# EAGLE schematic MKR_IMU_GPS_C_loop_v1 (2) (EAGLE 9.6.2)

## Sheet 1 of 4: 4-20mA->5V
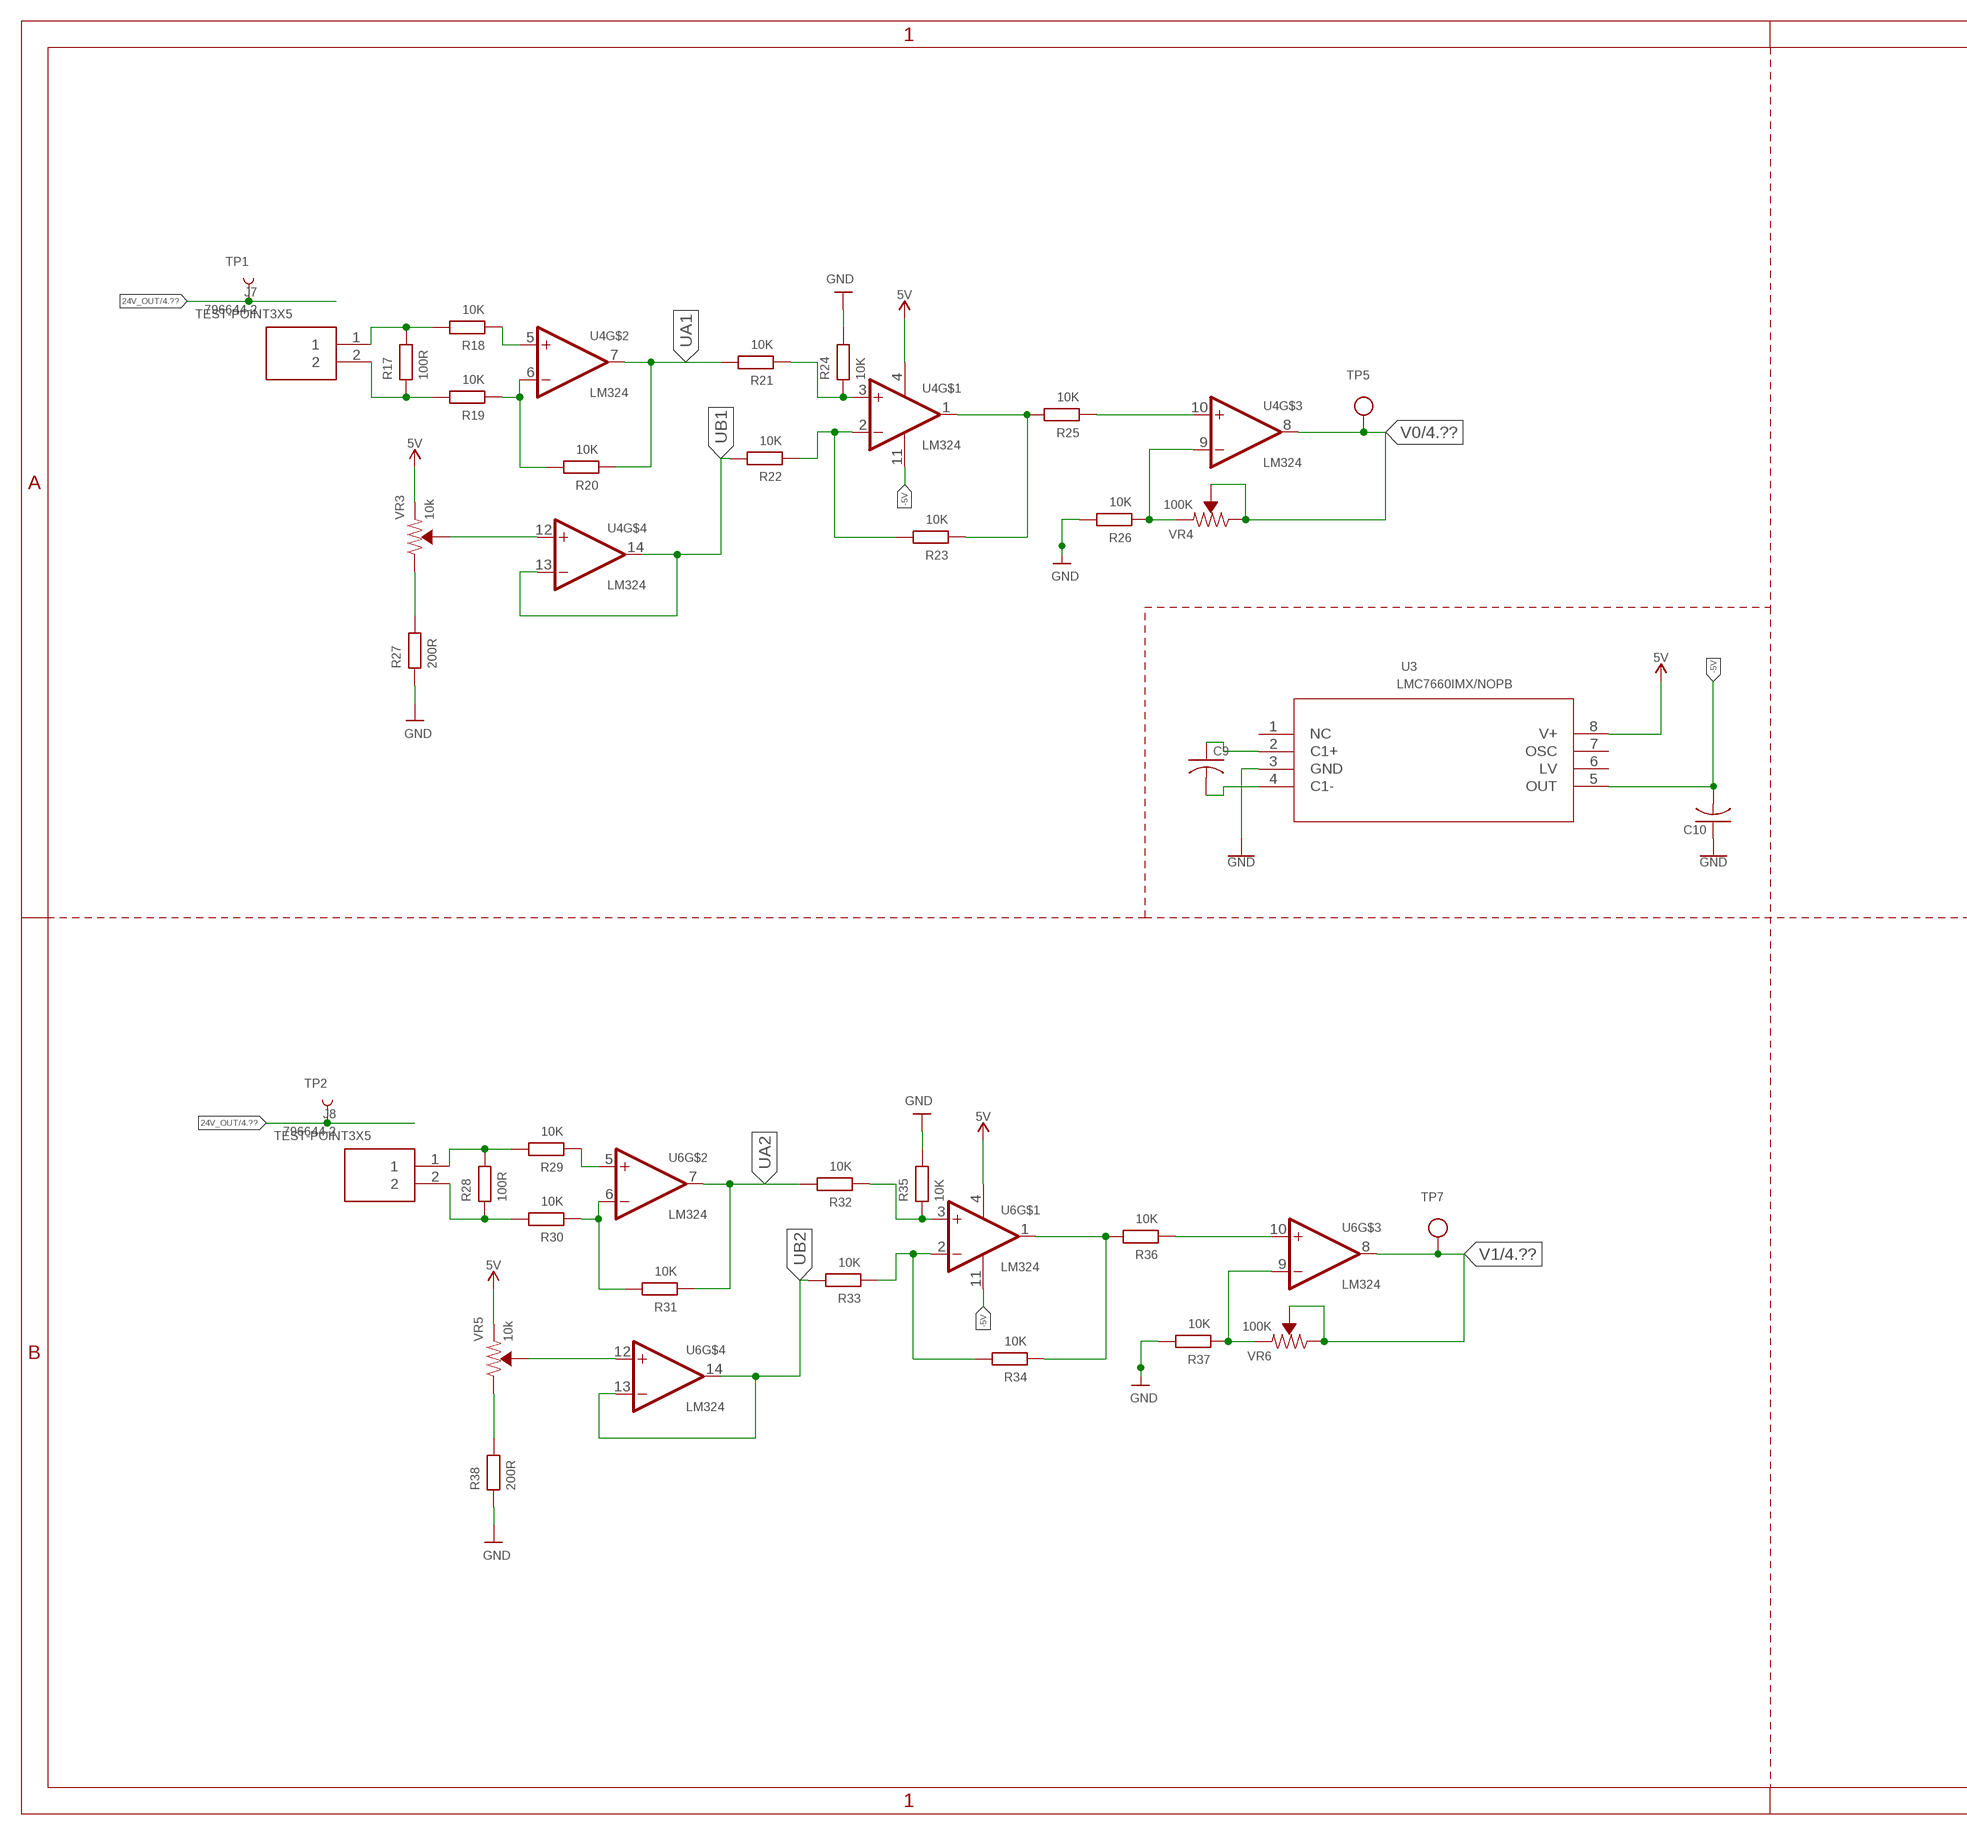
[diagram p0: schematic, sheet 1, part 1 of 2]
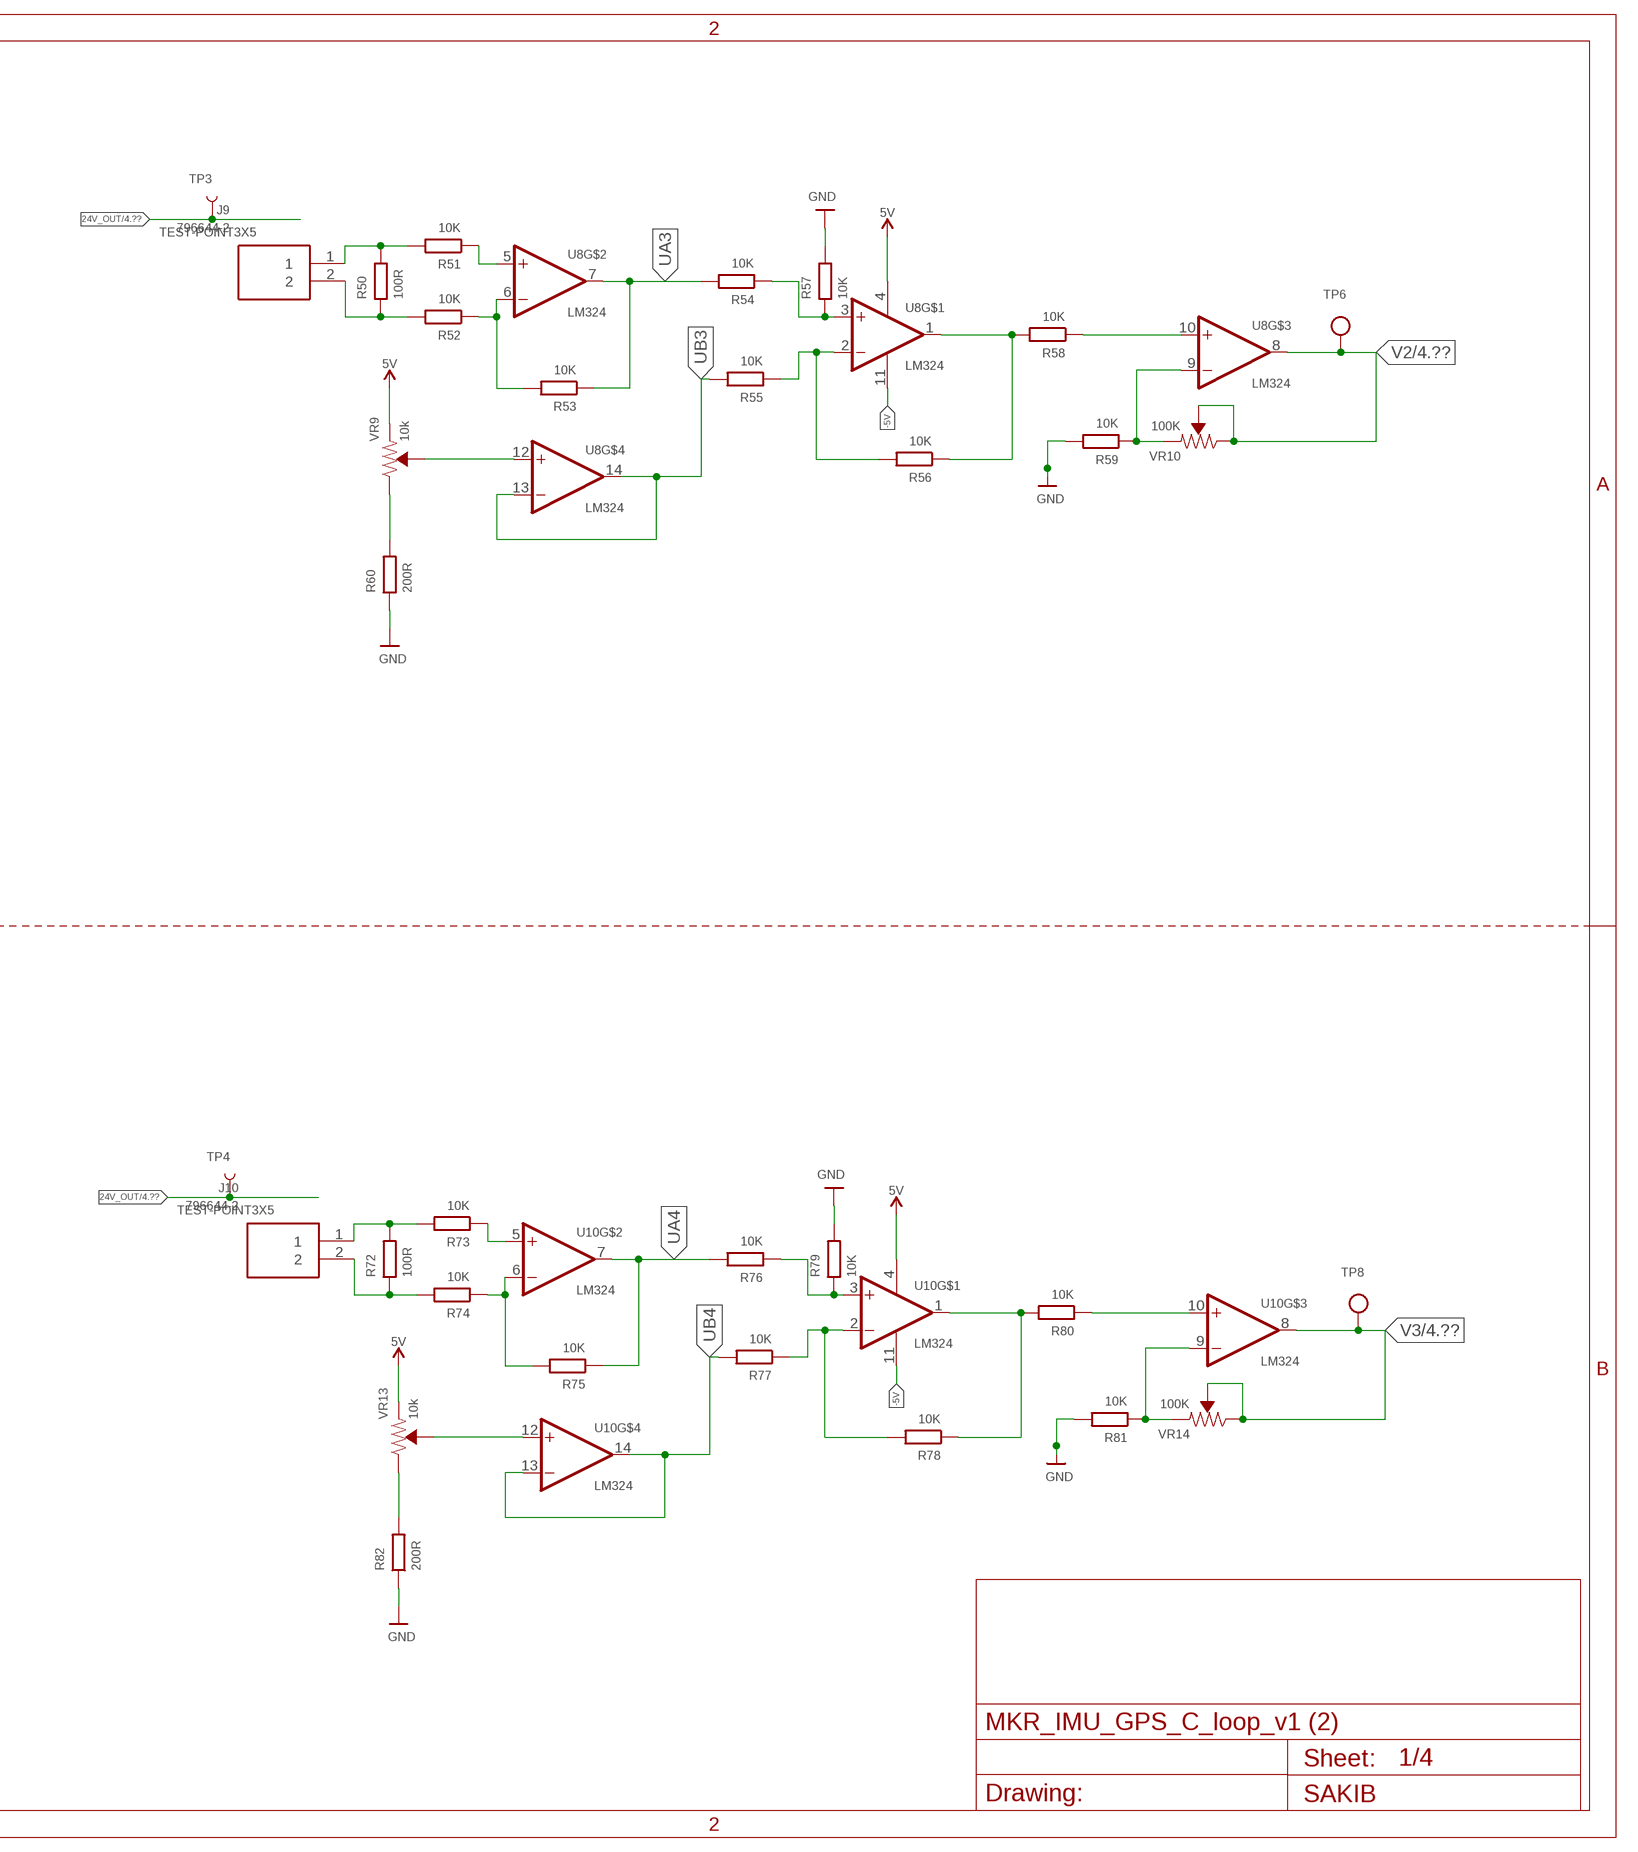
[diagram p1: schematic, sheet 1, part 2 of 2]

### Parts
C9  10uF  C-USC0402  [C0402]
C10  10uF  C-USC0402  [C0402]
J7  796644-2  [7966442]
J8  796644-2  [7966442]
J9  796644-2  [7966442]
J10  796644-2  [7966442]
R17  100R  R-EU_R0402  [R0402]
R18  10K  R-EU_R0402  [R0402]
R19  10K  R-EU_R0402  [R0402]
R20  10K  R-EU_R0402  [R0402]
R21  10K  R-EU_R0402  [R0402]
R22  10K  R-EU_R0402  [R0402]
R23  10K  R-EU_R0402  [R0402]
R24  10K  R-EU_R0402  [R0402]
R25  10K  R-EU_R0402  [R0402]
R26  10K  R-EU_R0402  [R0402]
R27  200R  R-EU_R0402  [R0402]
R28  100R  R-EU_R0402  [R0402]
R29  10K  R-EU_R0402  [R0402]
R30  10K  R-EU_R0402  [R0402]
R31  10K  R-EU_R0402  [R0402]
R32  10K  R-EU_R0402  [R0402]
R33  10K  R-EU_R0402  [R0402]
R34  10K  R-EU_R0402  [R0402]
R35  10K  R-EU_R0402  [R0402]
R36  10K  R-EU_R0402  [R0402]
R37  10K  R-EU_R0402  [R0402]
R38  200R  R-EU_R0402  [R0402]
R50  100R  R-EU_R0402  [R0402]
R51  10K  R-EU_R0402  [R0402]
R52  10K  R-EU_R0402  [R0402]
R53  10K  R-EU_R0402  [R0402]
R54  10K  R-EU_R0402  [R0402]
R55  10K  R-EU_R0402  [R0402]
R56  10K  R-EU_R0402  [R0402]
R57  10K  R-EU_R0402  [R0402]
R58  10K  R-EU_R0402  [R0402]
R59  10K  R-EU_R0402  [R0402]
R60  200R  R-EU_R0402  [R0402]
R72  100R  R-EU_R0402  [R0402]
R73  10K  R-EU_R0402  [R0402]
R74  10K  R-EU_R0402  [R0402]
R75  10K  R-EU_R0402  [R0402]
R76  10K  R-EU_R0402  [R0402]
R77  10K  R-EU_R0402  [R0402]
R78  10K  R-EU_R0402  [R0402]
R79  10K  R-EU_R0402  [R0402]
R80  10K  R-EU_R0402  [R0402]
R81  10K  R-EU_R0402  [R0402]
R82  200R  R-EU_R0402  [R0402]
TP1  TEST-POINT3X5  [PAD.03X.05]
TP2  TEST-POINT3X5  [PAD.03X.05]
TP3  TEST-POINT3X5  [PAD.03X.05]
TP4  TEST-POINT3X5  [PAD.03X.05]
TP5  TESTPOINTROUND2MM  [TESTPOINT_ROUND_2MM]
TP6  TESTPOINTROUND2MM  [TESTPOINT_ROUND_2MM]
TP7  TESTPOINTROUND2MM  [TESTPOINT_ROUND_2MM]
TP8  TESTPOINTROUND2MM  [TESTPOINT_ROUND_2MM]
U3  LMC7660IMX/NOPB  [M08A_TEX]
U4  LM324  [SOIC127P600X175-14N]
U6  LM324  [SOIC127P600X175-14N]
U8  LM324  [SOIC127P600X175-14N]
U10  LM324  [SOIC127P600X175-14N]
VR3  10k  TRIMPOT-SMD-3MM-CLOSED-1/8W-20%  [TRIMPOT-SMD-3MM-CLOSED]
VR4  100K  TRIMPOT-SMD-3MM-CLOSED-1/8W-20%  [TRIMPOT-SMD-3MM-CLOSED]
VR5  10k  TRIMPOT-SMD-3MM-CLOSED-1/8W-20%  [TRIMPOT-SMD-3MM-CLOSED]
VR6  100K  TRIMPOT-SMD-3MM-CLOSED-1/8W-20%  [TRIMPOT-SMD-3MM-CLOSED]
VR9  10k  TRIMPOT-SMD-3MM-CLOSED-1/8W-20%  [TRIMPOT-SMD-3MM-CLOSED]
VR10  100K  TRIMPOT-SMD-3MM-CLOSED-1/8W-20%  [TRIMPOT-SMD-3MM-CLOSED]
VR13  10k  TRIMPOT-SMD-3MM-CLOSED-1/8W-20%  [TRIMPOT-SMD-3MM-CLOSED]
VR14  100K  TRIMPOT-SMD-3MM-CLOSED-1/8W-20%  [TRIMPOT-SMD-3MM-CLOSED]

### Nets
5V: U3.8(V+) U4.4(VCC+) U6.4(VCC+) U8.4(VCC+) U10.4(VCC+) VR3.1(CCW) VR5.1(CCW) VR9.1(CCW) VR13.1(CCW) ; also sheet 3,4
24V_OUT: TP1.1 TP2.1 TP3.1 TP4.1 ; also sheet 4
-5V: C10.2 U3.5(OUT) U4.11(VCC-) U6.11(VCC-) U8.11(VCC-) U10.11(VCC-)
GND: C10.1 R24.2 R26.2 R27.1 R35.2 R37.2 R38.1 R57.2 R59.2 R60.1 R79.2 R81.2 R82.1 U3.3(GND) ; also sheet 2,3,4
N$8: C9.1 U3.2(C1+)
N$9: C9.2 U3.4(C1-)
N$19: J7.1 R17.2 R18.2
N$20: J7.2 R17.1 R19.2
N$21: R18.1 U4.5(NON-INVERTING_INPUT2)
N$22: R19.1 R20.2 U4.6(INVERTING_INPUT2)
N$23: R21.1 R24.1 U4.3(NON-INVERTING_INPUT1)
N$24: R23.1 R25.2 U4.1(OUTPUT1)
N$25: U4.12(NON-INVERTING_INPUT4) VR3.2(WIPER)
N$26: R27.2 VR3.3(CW)
N$27: R22.1 R23.2 U4.2(INVERTING_INPUT1)
N$28: R25.1 U4.10(NON-INVERTING_INPUT3)
N$29: R26.1 U4.9(INVERTING_INPUT3) VR4.1(CCW)
N$32: J8.1 R28.2 R29.2
N$33: J8.2 R28.1 R30.2
N$34: R29.1 U6.5(NON-INVERTING_INPUT2)
N$35: R30.1 R31.2 U6.6(INVERTING_INPUT2)
N$36: R32.1 R35.1 U6.3(NON-INVERTING_INPUT1)
N$37: R34.1 R36.2 U6.1(OUTPUT1)
N$38: U6.12(NON-INVERTING_INPUT4) VR5.2(WIPER)
N$39: R38.2 VR5.3(CW)
N$40: R33.1 R34.2 U6.2(INVERTING_INPUT1)
N$41: R36.1 U6.10(NON-INVERTING_INPUT3)
N$42: R37.1 U6.9(INVERTING_INPUT3) VR6.1(CCW)
N$54: J9.1 R50.2 R51.2
N$55: J9.2 R50.1 R52.2
N$56: R51.1 U8.5(NON-INVERTING_INPUT2)
N$57: R52.1 R53.2 U8.6(INVERTING_INPUT2)
N$58: R54.1 R57.1 U8.3(NON-INVERTING_INPUT1)
N$59: R56.1 R58.2 U8.1(OUTPUT1)
N$60: U8.12(NON-INVERTING_INPUT4) VR9.2(WIPER)
N$61: R60.2 VR9.3(CW)
N$62: R55.1 R56.2 U8.2(INVERTING_INPUT1)
N$63: R58.1 U8.10(NON-INVERTING_INPUT3)
N$64: R59.1 U8.9(INVERTING_INPUT3) VR10.1(CCW)
N$76: J10.1 R72.2 R73.2
N$78: J10.2 R72.1 R74.2
N$79: R73.1 U10.5(NON-INVERTING_INPUT2)
N$80: R74.1 R75.2 U10.6(INVERTING_INPUT2)
N$81: R76.1 R79.1 U10.3(NON-INVERTING_INPUT1)
N$82: R78.1 R80.2 U10.1(OUTPUT1)
N$83: U10.12(NON-INVERTING_INPUT4) VR13.2(WIPER)
N$84: R82.2 VR13.3(CW)
N$85: R77.1 R78.2 U10.2(INVERTING_INPUT1)
N$86: R80.1 U10.10(NON-INVERTING_INPUT3)
N$87: R81.1 U10.9(INVERTING_INPUT3) VR14.1(CCW)
UA1: R20.1 R21.2 U4.7(OUTPUT2)
UA2: R31.1 R32.2 U6.7(OUTPUT2)
UA3: R53.1 R54.2 U8.7(OUTPUT2)
UA4: R75.1 R76.2 U10.7(OUTPUT2)
UB1: R22.2 U4.13(INVERTING_INPUT4) U4.14(OUTPUT4)
UB2: R33.2 U6.13(INVERTING_INPUT4) U6.14(OUTPUT4)
UB3: R55.2 U8.13(INVERTING_INPUT4) U8.14(OUTPUT4)
UB4: R77.2 U10.13(INVERTING_INPUT4) U10.14(OUTPUT4)
V0: TP5.P$1 U4.8(OUTPUT3) VR4.2(WIPER) VR4.3(CW) ; also sheet 4
V1: TP7.P$1 U6.8(OUTPUT3) VR6.2(WIPER) VR6.3(CW) ; also sheet 4
V2: TP6.P$1 U8.8(OUTPUT3) VR10.2(WIPER) VR10.3(CW) ; also sheet 4
V3: TP8.P$1 U10.8(OUTPUT3) VR14.2(WIPER) VR14.3(CW) ; also sheet 4
Unconnected: U3.1(NC) U3.6(LV) U3.7(OSC)

### Notes on the sheet
- Sheet:
- Drawing: | SAKIB

## Sheet 2 of 4: IMU,GPS,SD
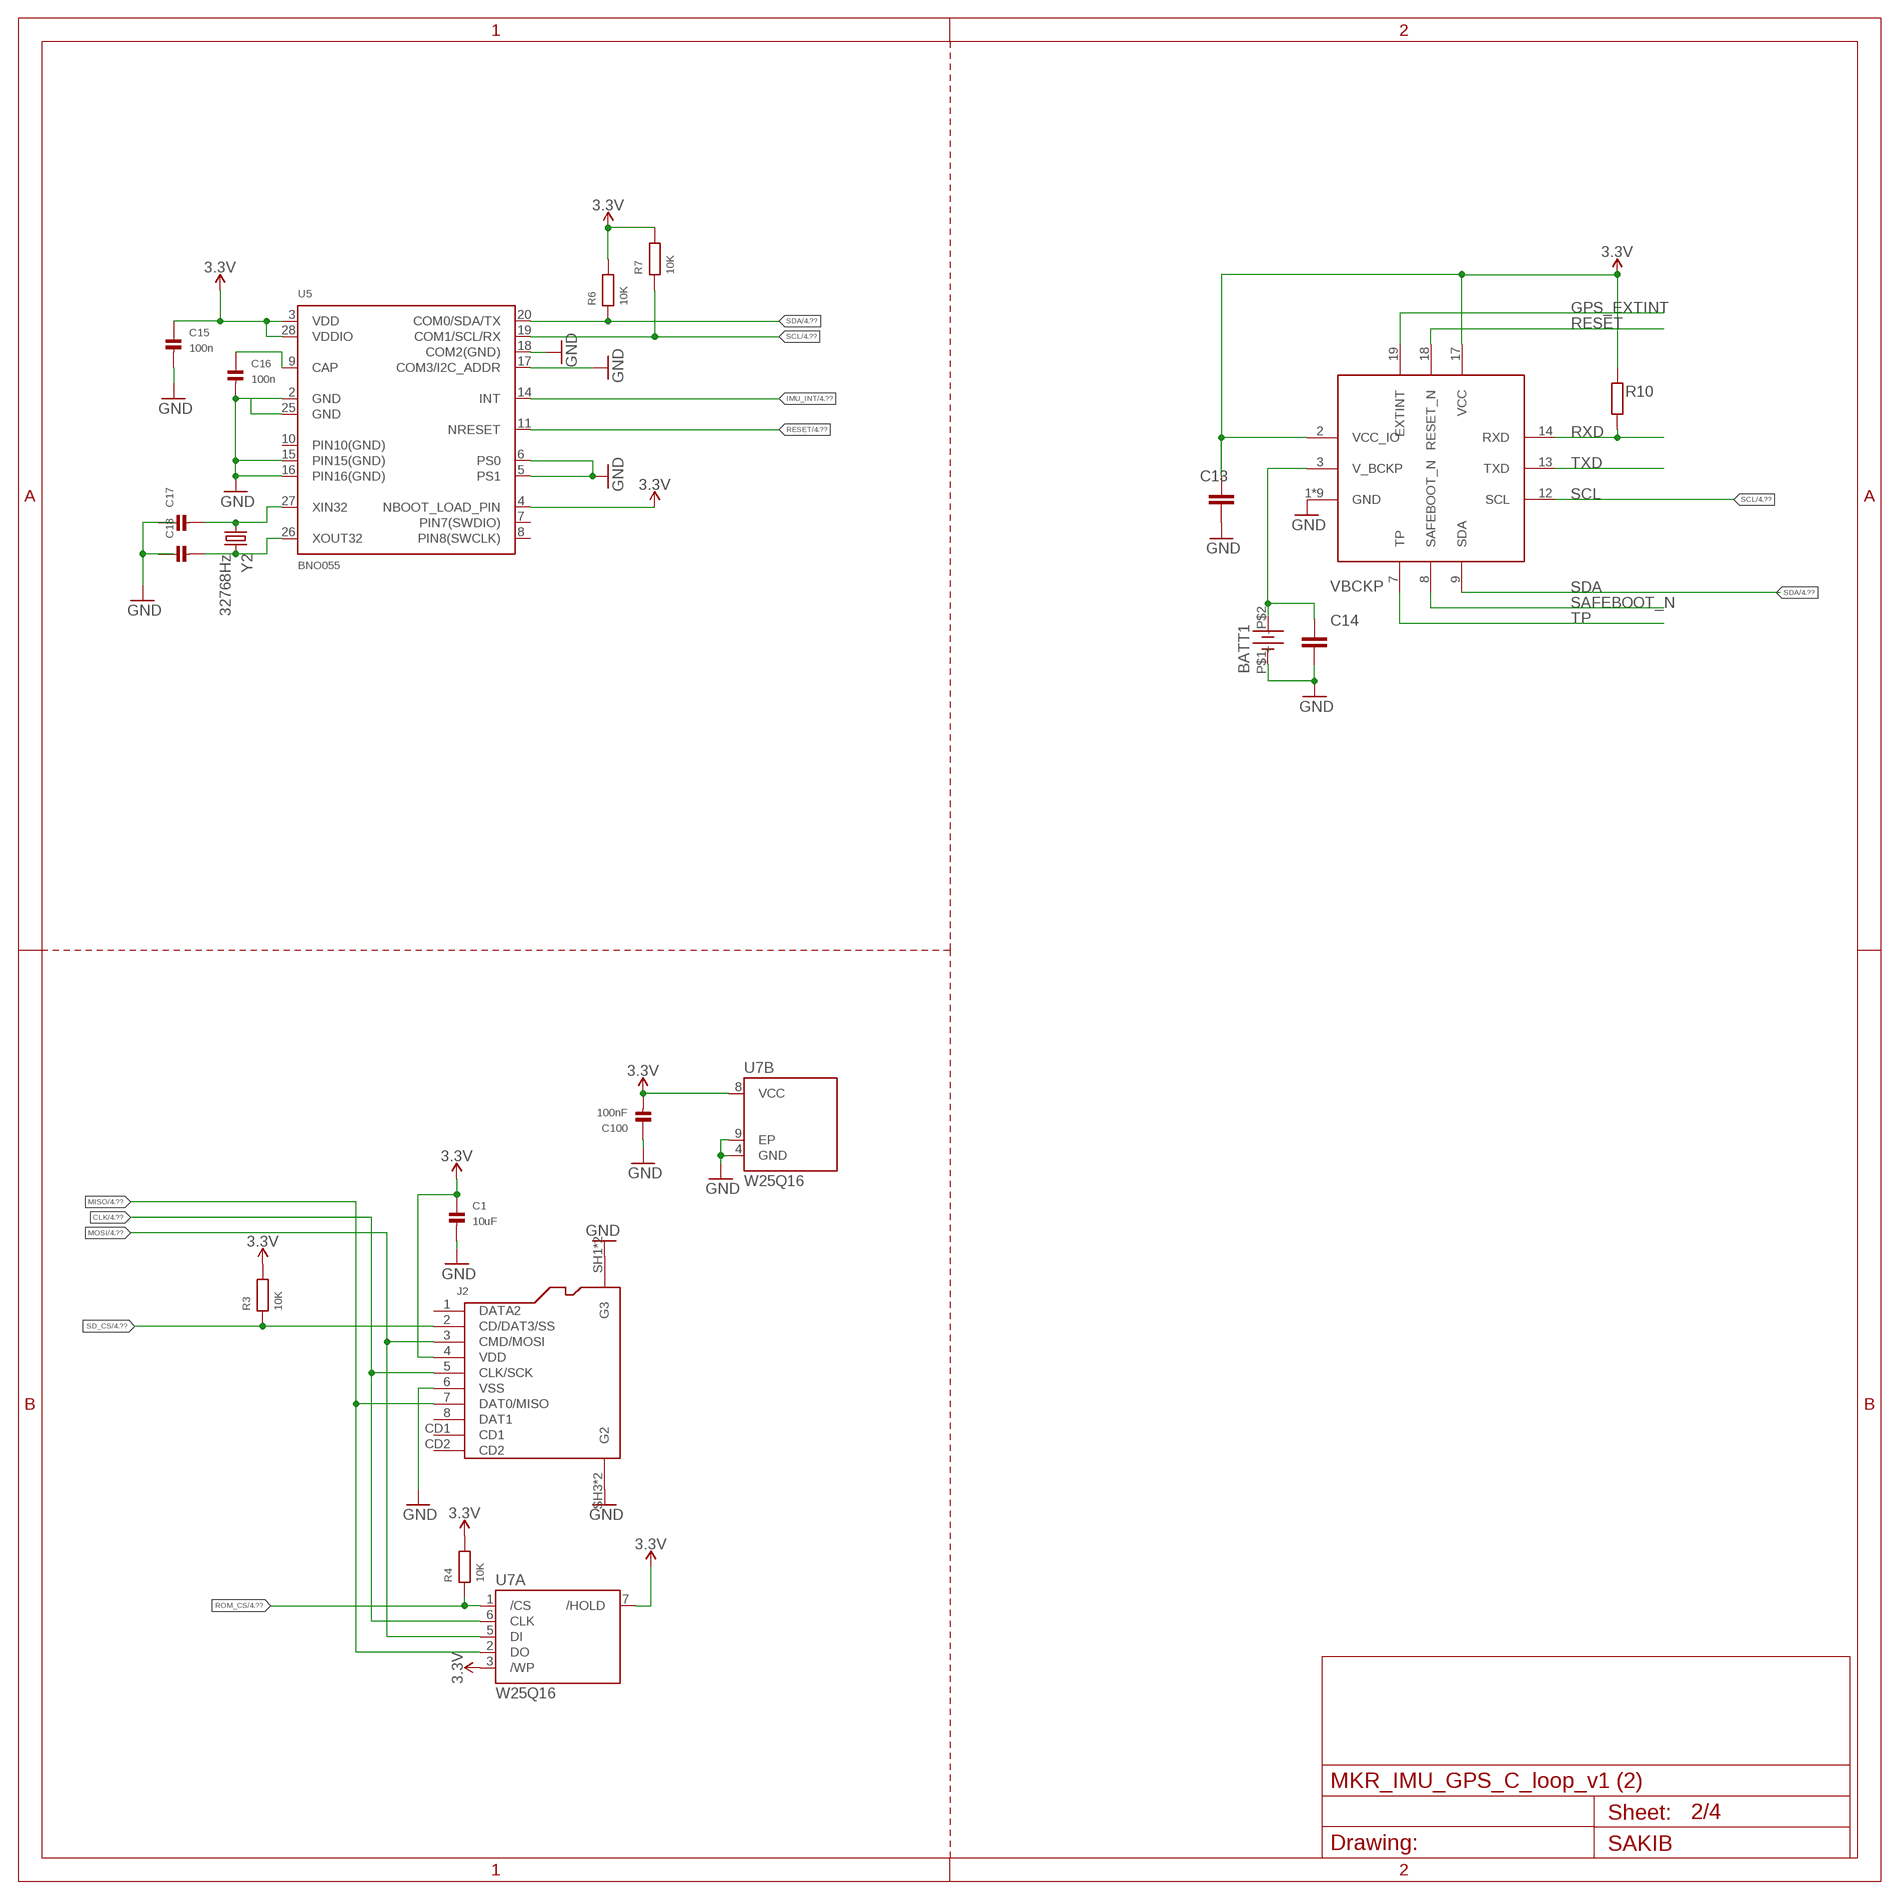
[diagram p2: schematic, sheet 2]

### Parts
BATT1  BATT-HOLDER_12MM  [BATT-HOLDER_12MM]
C1  10uF  CAP_CERAMIC_0603MP  [_0603MP]
C13  100n  C-EUC0402  [C0402]
C14  100n  C-EUC0402  [C0402]
C15  100n  CAP_CERAMIC_0402MP  [_0402MP]
C16  100n  CAP_CERAMIC_0402MP  [_0402MP]
C17  CAP_CERAMIC_0402MP  [_0402MP]
C18  CAP_CERAMIC_0402MP  [_0402MP]
C100  100nF  CAP_CERAMIC_0402MP  [_0402MP]
IC2  SAM-M8Q  [UBLOXLIB_SAM-M8Q]
J2  -  SD_AMPHENOL  [AMPHENOL_114-00841-68]
R3  10K  R-EU_R0402  [R0402]
R4  10K  R-EU_R0402  [R0402]
R6  10K  R-EU_R0402  [R0402]
R7  10K  R-EU_R0402  [R0402]
R10  100k  R-EU_R0402  [R0402]
U5  BNO055  [BNO055]
U7  W25Q16  W25Q16DVZPIG  [SON9P127_500X600X80L60X41T340X400N]
Y2  32768Hz  32.768KHZ  [ABS07]

### Nets
3.3V: C1.1 C13.1 C15.1 C100.2 IC2.2(VCC_IO) IC2.17(VCC) J2.4(VDD) R3.2 R4.2 R6.2 R7.2 R10.2 U5.3(VDD) U5.4(NBOOT_LOAD_PIN) U5.28(VDDIO) U7.3(A:/WP) U7.7(A:/HOLD) U7.8(B:VCC) ; also sheet 3,4
CLK: J2.5(CLK/SCK) U7.6(A:CLK) ; also sheet 4
GND: BATT1.P$1(-) C1.2 C13.2 C14.2 C15.2 C16.2 C17.1 C18.1 C100.1 IC2.1(GND) IC2.4(GND) IC2.5(GND) IC2.6(GND) IC2.10(GND) IC2.11(GND) IC2.15(GND) IC2.16(GND) IC2.20(GND) J2.6(VSS) J2.SH1(G3) J2.SH2(G3) J2.SH3(G2) J2.SH4(G2) U5.2(GND) U5.5(PS1) U5.6(PS0) U5.15(PIN15(GND)) U5.16(PIN16(GND)) U5.17(COM3/I2C_ADDR) U5.18(COM2(GND)) U7.4(B:GND) U7.9(B:EP) ; also sheet 1,3,4
GPS_EXTINT: IC2.19(EXTINT) ; also sheet 4
IMU_INT: U5.14(INT) ; also sheet 4
MISO: J2.7(DAT0/MISO) U7.2(A:DO) ; also sheet 4
MOSI: J2.3(CMD/MOSI) U7.5(A:DI) ; also sheet 4
N$10: C17.2 U5.27(XIN32) Y2.1
N$11: C18.2 U5.26(XOUT32) Y2.2
N$12: C16.1 U5.9(CAP)
N$13: U5.25(GND)
RESET: IC2.18(RESET_N) U5.11(NRESET) ; also sheet 4
ROM_CS: R4.1 U7.1(A:/CS) ; also sheet 4
RXD: IC2.14(RXD) R10.1
SAFEBOOT_N: IC2.8(SAFEBOOT_N)
SCL: IC2.12(SCL) R7.1 U5.19(COM1/SCL/RX) ; also sheet 4
SD_CS: J2.2(CD/DAT3/SS) R3.1 ; also sheet 4
SDA: IC2.9(SDA) R6.1 U5.20(COM0/SDA/TX) ; also sheet 4
TP: IC2.7(TP)
TXD: IC2.13(TXD)
VBCKP: BATT1.P$2(+) C14.1 IC2.3(V_BCKP)
Unconnected: J2.1(DATA2) J2.8(DAT1) J2.CD1 J2.CD2 U5.7(PIN7(SWDIO)) U5.8(PIN8(SWCLK)) U5.10(PIN10(GND))

### Notes on the sheet
- Sheet:
- Drawing: | SAKIB

## Sheet 3 of 4: Voltage regulator
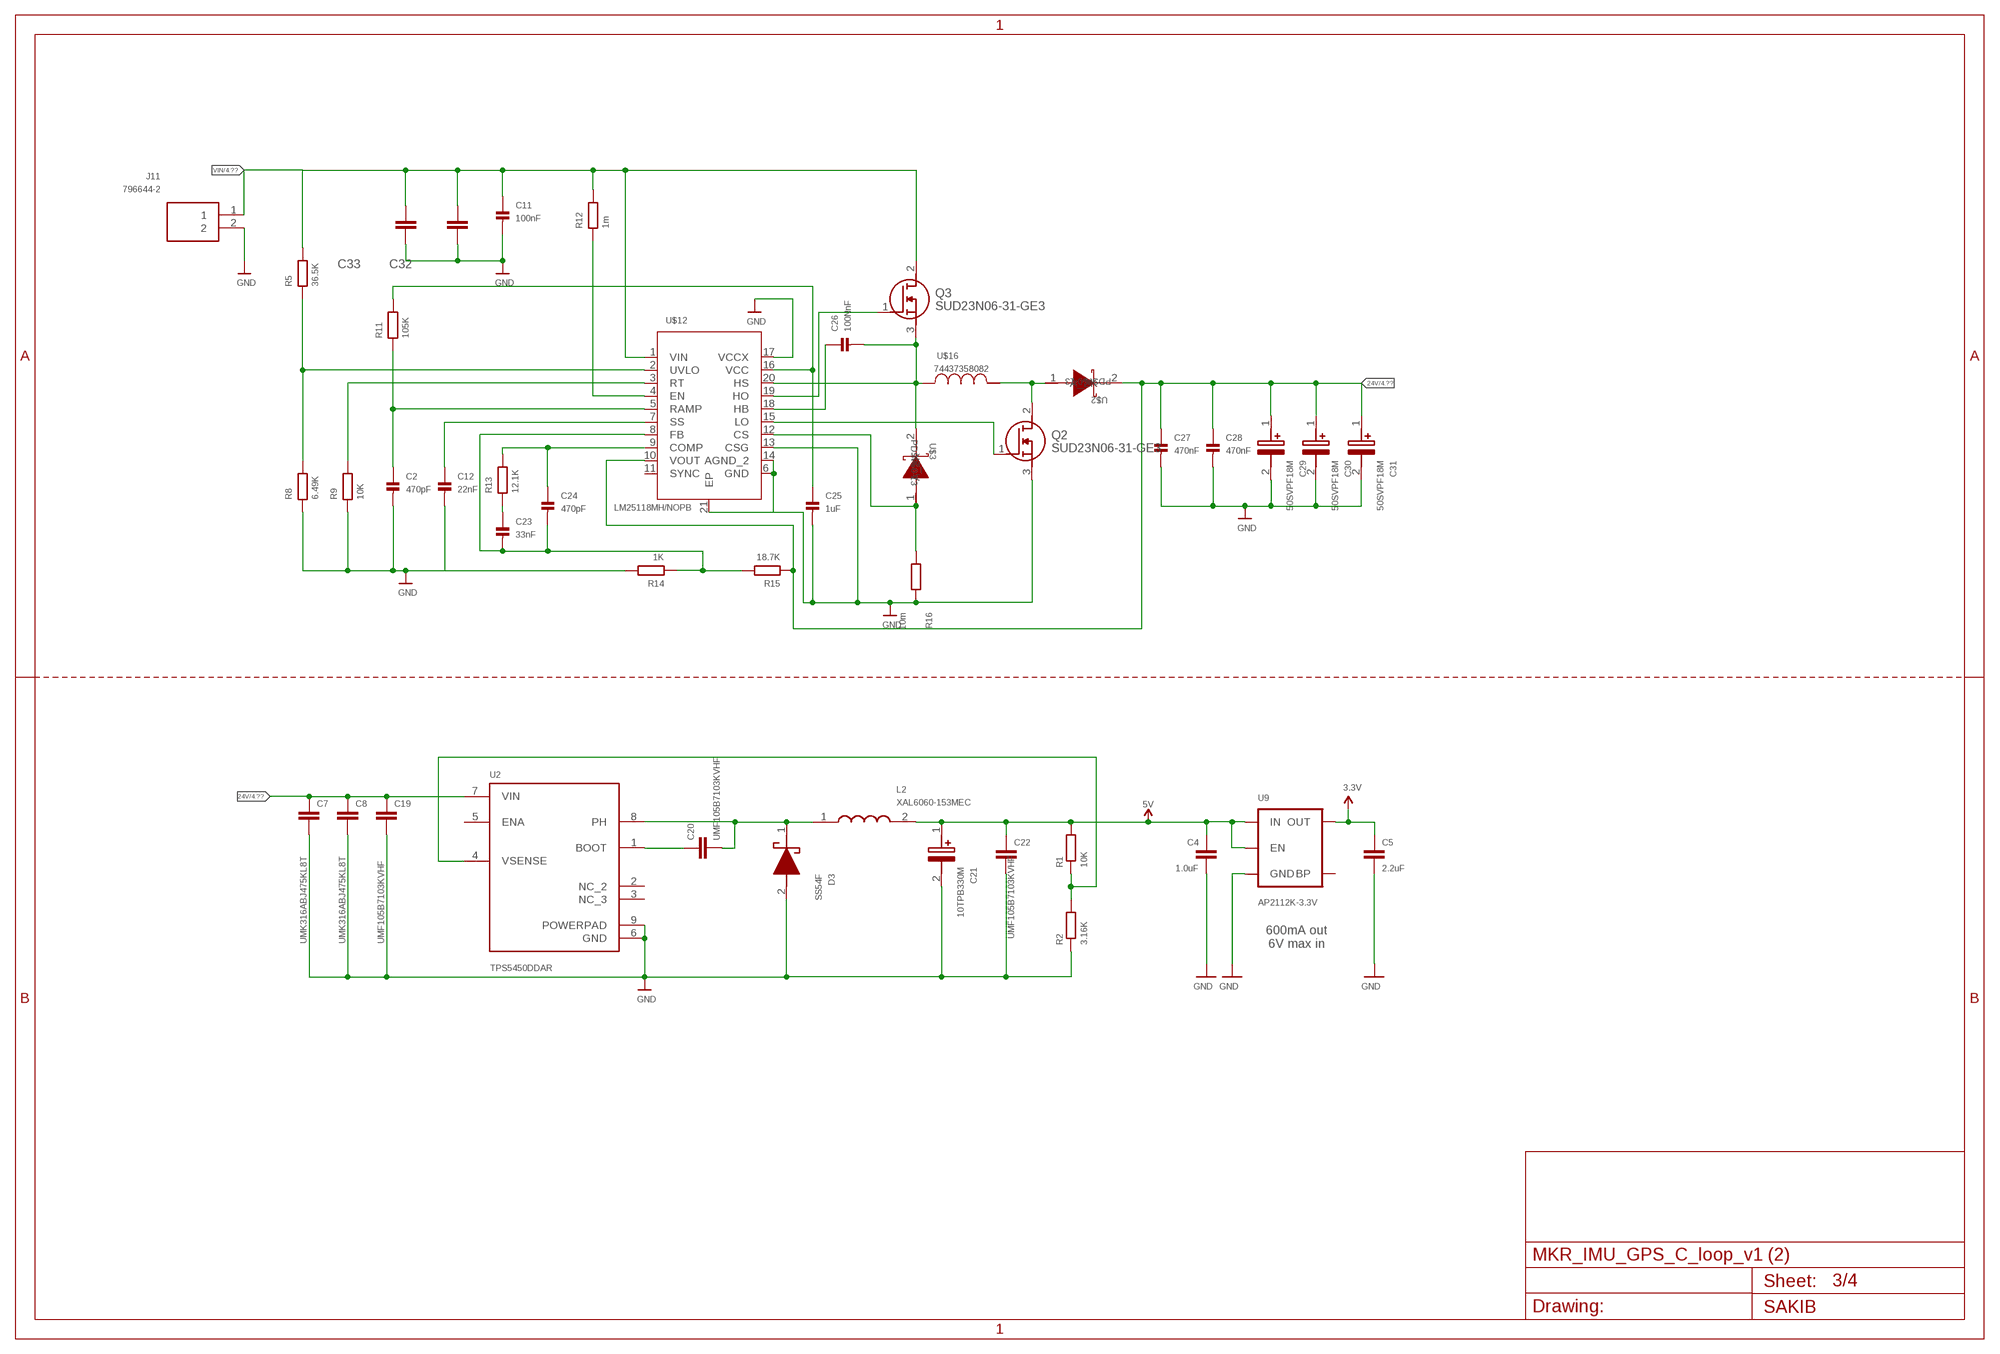
[diagram p3: schematic, sheet 3]

### Parts
C2  470pF  CAP_CERAMIC_0402MP  [_0402MP]
C4  1.0uF  1.0UF-0805-25V-(+80/-20%)  [0805]
C5  2.2uF  2.2UF-0603-10V-20%  [0603]
C7  UMK316ABJ475KL8T  C-EUC1206  [C1206]
C8  UMK316ABJ475KL8T  C-EUC1206  [C1206]
C11  100nF  CAP_CERAMIC_0402MP  [_0402MP]
C12  22nF  CAP_CERAMIC_0402MP  [_0402MP]
C19  UMF105B7103KVHF  C-EUC0402  [C0402]
C20  UMF105B7103KVHF  C-EUC0402  [C0402]
C21  10TPB330M  [CAPPM7343X400N]
C22  UMF105B7103KVHF  C-EUC0402  [C0402]
C23  33nF  CAP_CERAMIC_0402MP  [_0402MP]
C24  470pF  CAP_CERAMIC_0402MP  [_0402MP]
C25  1uF  CAP_CERAMIC_0402MP  [_0402MP]
C26  100NnF  CAP_CERAMIC_0402MP  [_0402MP]
C27  470nF  CAP_CERAMIC_0402MP  [_0402MP]
C28  470nF  CAP_CERAMIC_0402MP  [_0402MP]
C29  50SVPF18M  [16SVF270M]
C30  50SVPF18M  [16SVF270M]
C31  50SVPF18M  [16SVF270M]
C32  C-EUC0402  [C0402]
C33  C-EUC0402  [C0402]
D3  SS54F  [SODFL4626X130N]
J11  796644-2  [7966442]
L2  XAL6060-153MEC  [XAL6060153MEC]
Q2  SUD23N06-31-GE3  [SUD23N0631GE3]
Q3  SUD23N06-31-GE3  [SUD23N0631GE3]
R1  10K  R-EU_R0402  [R0402]
R2  3.16K  R-EU_R0402  [R0402]
R5  36.5K  R-EU_R0402  [R0402]
R8  6.49K  R-EU_R0402  [R0402]
R9  10K  R-EU_R0402  [R0402]
R11  105K  R-EU_R0402  [R0402]
R12  1m  R-EU_R0402  [R0402]
R13  12.1K  R-EU_R0402  [R0402]
R14  1K  R-EU_R0402  [R0402]
R15  18.7K  R-EU_R0402  [R0402]
R16  10m  R-EU_R0402  [R0402]
U2  TPS5450DDAR  [CONV_TPS5450DDAR]
U9  AP2112K-3.3V  V_REG_LDOSMD  [SOT23-5]
U$2  PDS760-13  [POWERDI5]
U$3  PDS760-13  [POWERDI5]
U$12  LM25118MH/NOPB  [MXA20A]
U$16  74437358082  [WE-LHMI_8040]

### Nets
3.3V: C5.1 U9.5(OUT) ; also sheet 2,4
5V: C4.1 C21.1(+) C22.1 L2.2 R1.2 U9.1(IN) U9.3(EN) ; also sheet 1,4
24V: C7.1 C8.1 C19.1 C27.1 C28.1 C29.1(+) C30.1(+) C31.1(+) R15.1 U2.7(VIN) U$2.2(K) U$12.10(VOUT) ; also sheet 4
GND: C2.2 C4.2 C5.2 C7.2 C8.2 C11.2 C12.2 C19.2 C21.2(-) C22.2 C25.2 C27.2 C28.2 C29.2(-) C30.2(-) C31.2(-) C32.1 C33.1 D3.2(A) J11.2 Q2.3(S) R2.1 R8.1 R9.1 R14.2 R16.2 U2.6(GND) U2.9(POWERPAD) U9.2(GND) U$12.6(GND) U$12.13(CSG) U$12.14(AGND_2) U$12.17(VCCX) U$12.21(EP) ; also sheet 1,2,4
N$1: C24.1 R13.2 U$12.9(COMP)
N$2: C23.1 R13.1
N$3: C23.2 C24.2 R14.1 R15.2 U$12.8(FB)
N$4: C12.1 U$12.7(SS)
N$5: C20.1 U2.1(BOOT)
N$6: C20.2 D3.1(K) L2.1 U2.8(PH)
N$7: C2.1 R11.1 U$12.5(RAMP)
N$30: R1.1 R2.2 U2.4(VSENSE)
N$31: C25.1 R11.2 U$12.16(VCC)
N$43: R9.2 U$12.3(RT)
N$44: R5.1 R8.2 U$12.2(UVLO)
N$45: R12.1 U$12.4(EN)
N$47: C26.1 U$12.18(HB)
N$48: Q3.1(G) U$12.19(HO)
N$52: C26.2 Q3.3(S) U$3.2(K) U$12.20(HS) U$16.2
N$53: R16.1 U$3.1(A_2) U$12.12(CS)
N$65: Q2.1(G) U$12.15(LO)
N$66: Q2.2(D) U$2.1(A_2) U$16.1
VIN: C11.1 C32.2 C33.2 J11.1 Q3.2(D) R5.2 R12.2 U$12.1(VIN) ; also sheet 4
Unconnected: U2.2(NC_2) U2.3(NC_3) U2.5(ENA) U9.4(BP) U$12.11(SYNC)

### Notes on the sheet
- 600mA out
  6V max in
- Sheet:
- Drawing: | SAKIB

## Sheet 4 of 4: MKR_wifi_1010_other peripheral
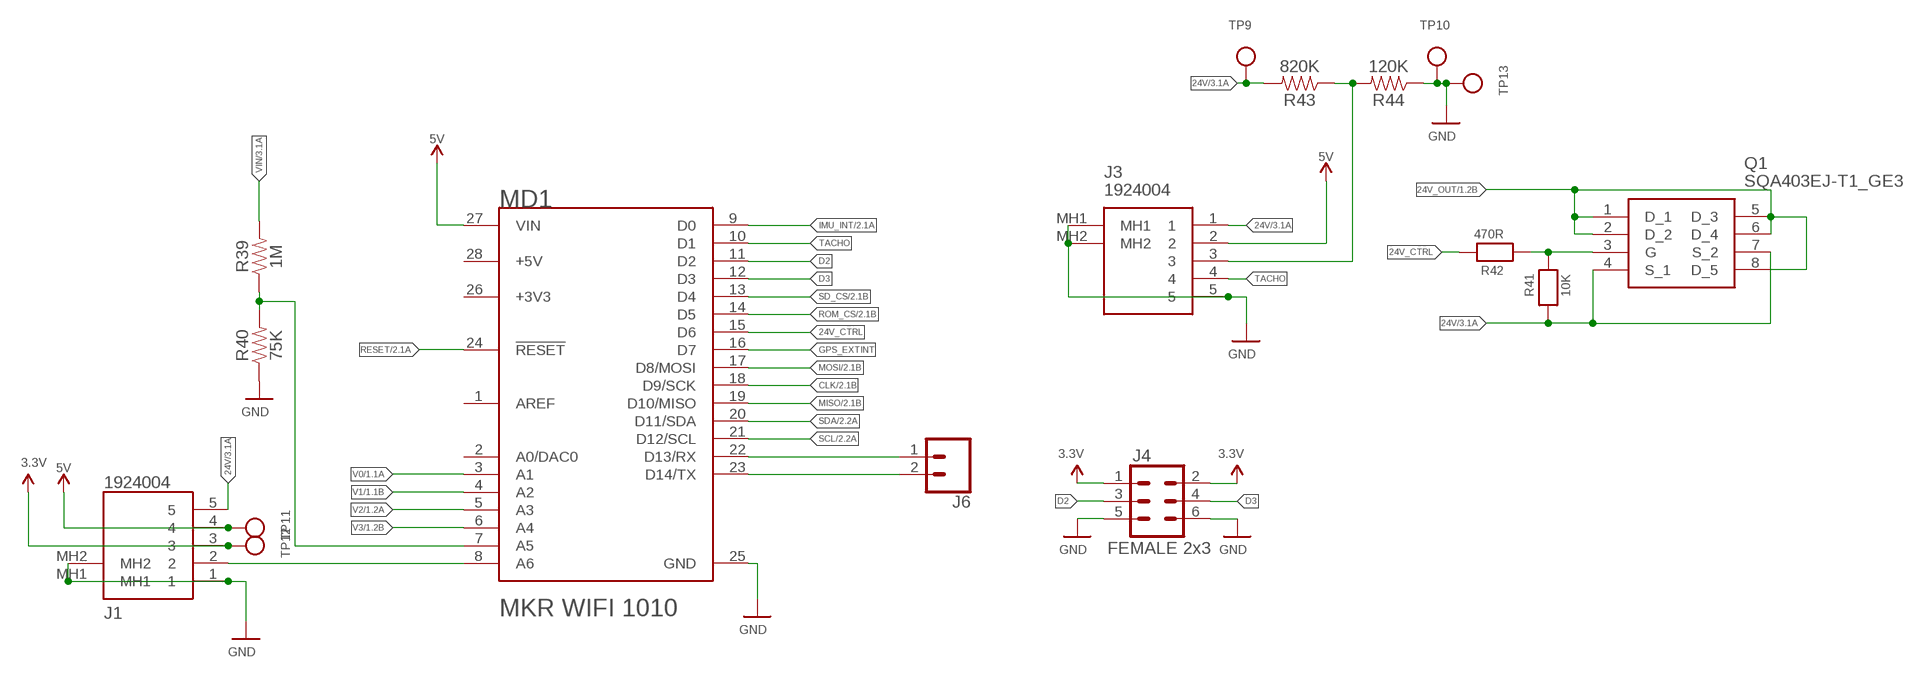
[diagram p4: schematic, sheet 4]

### Parts
J1  1924004  [1924004]
J3  1924004  [1924004]
J4  FEMALE 2x3  CONN_03X2FEMALE  [2X3]
J6  CONN_02  [1X02]
MD1  ARDUINO_MKR_WIFI_1010ARDUINO_MKR_WIFI_1010_0_0  [ARDUINO_MKR_WIFI_1010_0]
Q1  SQA403EJ-T1_GE3  [SQA403EJT1_GE3]
R39  1M  1MOHM-0402T-1/16W-5%  [0402-TIGHT]
R40  75K  1MOHM-0402T-1/16W-5%  [0402-TIGHT]
R41  10K  RESISTOR_0402MP  [_0402MP]
R42  470R  RESISTOR_0402MP  [_0402MP]
R43  820K  1MOHM-0402T-1/16W-5%  [0402-TIGHT]
R44  120K  1MOHM-0402T-1/16W-5%  [0402-TIGHT]
TP9  TESTPOINTROUND2MM  [TESTPOINT_ROUND_2MM]
TP10  TESTPOINTROUND2MM  [TESTPOINT_ROUND_2MM]
TP11  TESTPOINTROUND2MM  [TESTPOINT_ROUND_2MM]
TP12  TESTPOINTROUND2MM  [TESTPOINT_ROUND_2MM]
TP13  TESTPOINTROUND2MM  [TESTPOINT_ROUND_2MM]

### Nets
3.3V: J1.3 J4.1 J4.2 TP12.P$1 ; also sheet 2,3
5V: J1.4 J3.2 MD1.27(VIN) TP11.P$1 ; also sheet 1,3
24V: J1.5 J3.1 Q1.4(S_1) Q1.7(S_2) R41.1 R43.2 TP9.P$1 ; also sheet 3
24V_CTRL: MD1.15(D6) R42.2
24V_OUT: Q1.1(D_1) Q1.2(D_2) Q1.5(D_3) Q1.6(D_4) Q1.8(D_5) ; also sheet 1
CLK: MD1.18(D9/SCK) ; also sheet 2
D2: J4.3 MD1.11(D2)
D3: J4.4 MD1.12(D3)
GND: J1.1 J1.MH1 J1.MH2 J3.5 J3.MH1 J3.MH2 J4.5 J4.6 MD1.25(GND) R40.1 R44.1 TP10.P$1 TP13.P$1 ; also sheet 1,2,3
GPS_EXTINT: MD1.16(D7) ; also sheet 2
IMU_INT: MD1.9(D0) ; also sheet 2
MISO: MD1.19(D10/MISO) ; also sheet 2
MOSI: MD1.17(D8/MOSI) ; also sheet 2
N$14: MD1.7(A5) R39.1 R40.2
N$15: J3.3 R43.1 R44.2
N$46: J1.2 MD1.8(A6)
N$89: J6.1 MD1.22(D13/RX)
N$90: J6.2 MD1.23(D14/TX)
RESET: MD1.24(!RESET!) ; also sheet 2
ROM_CS: MD1.14(D5) ; also sheet 2
SCL: MD1.21(D12/SCL) ; also sheet 2
SD_CS: MD1.13(D4) ; also sheet 2
SDA: MD1.20(D11/SDA) ; also sheet 2
TACHO: J3.4 MD1.10(D1)
V0: MD1.3(A1) ; also sheet 1
V1: MD1.4(A2) ; also sheet 1
V2: MD1.5(A3) ; also sheet 1
V3: MD1.6(A4) ; also sheet 1
VIN: R39.2 ; also sheet 3
X: Q1.3(G) R41.2 R42.1
Unconnected: MD1.1(AREF) MD1.2(A0/DAC0)

## Power pins joined to a net without a drawn wire
+3V3: MD1.26(+3V3)
+5V: MD1.28(+5V)

## Library data of the parts
BATT1 = Arduino-connectors:BATT-HOLDER_12MM: 12.5mm coincell battery holder; CODE-ARDUINO: A5379; DATASHEET: http://keyelco.com/userAssets/file/M65p2.pdf; DISTRIBUTOR-LINK: https://www.digikey.it/product-detail/it/keystone-electronics/1056TR/36-1056CT-ND/4772075; DISTRIBUTOR-PN: 36-1056CT-ND; MANUFACTURER: Keystone; MANUFACTURER-PN: 1056TR
C1 C2 C11 C12 C15-C18 C23-C28 C100 = microbuilder:CAP_CERAMIC: Ceramic Capacitors 0402 - 0402 Surface Mount Capacitors 16pF 50V 5% [Digikey: 445-4899-2-ND] 18pF 50V 5% [Digikey: 490-1281-2-ND] 22pF 50V 5% [Digikey: 490-1283-2-ND] 68pF 50V 5% [Digikey: 490-1289-2-ND] 0.1uF 10V 10% [Digikey: 490-1318-2-ND] 1.0uF 6.3V 10% [Digikey: 490-1320-2-ND] 0603 - 0603 Surface Mount Capacitors 16 pF 50V 5% [Digikey: 445-5051-2-ND] 22 pF 50V [Digikey: PCC220ACVTR-ND] 33 pF 50V 5% [Digikey: 490-1415-1-ND] 56pF 50V 5% [Digikey: 490-1421-1-ND] 220pF 50V 5% [Digikey: 445-1285-1-ND] 680 pF 50V 2200 pF 50V 5% C0G [Digikey: 445-1297-1-ND] 5600 pF 100V 5% X7R [Digikey: 478-3711-1-ND] 0.1 µF 25V 10% [Digikey: PCC2277TR-ND] 0.22 µF 16V 10% X7R [Digikey: 445-1318-1-ND] 1.0 µF 25V 10% [Digikey: 445-5146-2-ND] 0603 - RF Specific 3pF 250V +/-0.1pF RF [Digikey: 712-1347-1-ND] 18 pF 250V 5% [Digikey: 478-3505-1-ND or 712-1322-1-ND] 56 pF 250V 5% C0G RF [Digikey: 490-4867-1-ND] 68 pF 250V RF [Digikey: 490-4868-1-ND] 0805 - 0805 Surface Mount Capacitors 220 pF 250V 2% RF Ceramic Capacitor [Digikey: 712-1398-1-ND] 1000 pF 50V 2% NP0 Ceramic Capacitor [Digikey: 478-3760-1-ND] 0.1 µF 25V 10% Ceramic Capacitor [Digikey: PCC1828TR-ND] 1.0 µF 16V 10% Ceramic Capacitor[Digikey: 490-1691-2-ND] 10.0 µF 10V 10% Ceramic Capacitor[Digikey: 709-1228-1-ND] 10.0 uF 16V 10% Ceramic Capacitor [Digikey: 478-5165-2-ND] 47 uF 6.3V 20% Ceramic Capacitor [Digikey: 587-1779-1-ND or 399-5506-1-ND] 1206 - 1206 Surface Mount Capacitors 47uF 10V 20% Ceramic Capacitor [Digikey: 490-5528-1-ND or 399-5508-1-ND or 445-6010-1-ND] 100uF 6.3V -20%, +80% Y5V Ceramic Capacitor (Digikey: 490-4512-1-ND, Mouser: 81-GRM31CF50J107ZE1L)
C4 = SparkFun-Capacitors:1.0UF: 1µF ceramic capacitors A capacitor is a passive two-terminal electrical component used to store electrical energy temporarily in an electric field.; PROD_ID: CAP-11625
C5 = SparkFun-Capacitors:2.2UF: 2.2µF ceramic capacitors A capacitor is a passive two-terminal electrical component used to store electrical energy temporarily in an electric field.; PROD_ID: CAP-07888
C7 C8 C13 C19 C20 C22 C32 C33 = rcl:C-EU: CAPACITOR, European symbol; SPICEPREFIX: C
C9 C10 = rcl:C-US: CAPACITOR, American symbol; SPICEPREFIX: C
C14 = rcl:C-EU: CAPACITOR, European symbol; SPICEPREFIX: C; VOLTAGE: 25V
C21 = SamacSys_Parts:10TPB330M: Panasonic 330uF SMD Solid Polymer Tantalum Capacitor, 10 V +/-20%, POSCAP Series Source: Datasheet <http://uk.rs-online.com/web/p/products/1038644>; ARROW_PART_NUMBER: 10TPB330M; ARROW_PRICE-STOCK: https://www.arrow.com/en/products/10tpb330m/panasonic?region=nac; DESCRIPTION: Panasonic 330uF SMD Solid Polymer Tantalum Capacitor, 10 V +/-20%, POSCAP Series; HEIGHT: 4mm; MANUFACTURER_NAME: Panasonic; MANUFACTURER_PART_NUMBER: 10TPB330M; MOUSER_PART_NUMBER: 667-10TPB330M; MOUSER_PRICE-STOCK: https://www.mouser.co.uk/ProductDetail/Panasonic/10TPB330M?qs=OE1iw1LrrPGJ%2FhG9UwG4gg%3D%3D
C29-C31 = SamacSys_Parts:50SVPF18M: Panasonic 18uF 50 V dc Polymer Aluminium Electrolytic Capacitor E7, OS-CON Series 5000h 8 x 6.9mm Source: Datasheet <http://industrial.panasonic.com/cdbs/www-data/pdf/AAB8000/AAB8000C177.pdf>; ARROW_PART_NUMBER: 50SVPF18M; ARROW_PRICE-STOCK: https://www.arrow.com/en/products/50svpf18m/panasonic; DESCRIPTION: Panasonic 18uF 50 V dc Polymer Aluminium Electrolytic Capacitor E7, OS-CON Series 5000h 8 x 6.9mm; HEIGHT: 7mm; MANUFACTURER_NAME: Panasonic; MANUFACTURER_PART_NUMBER: 50SVPF18M; MOUSER_PART_NUMBER: 667-50SVPF18M; MOUSER_PRICE-STOCK: https://www.mouser.co.uk/ProductDetail/Panasonic/50SVPF18M/?qs=OE1iw1LrrPH3UQONhtXAdQ%3D%3D
D3 = SamacSys_Parts:SS54F: SURFACE MOUNT SCHOTTKY BARRIER RECTIFIER Source: Datasheet <https://datasheet.lcsc.com/szlcsc/1903042031_MDD-Jiangsu-Yutai-Elec-SS54F_C64882.pdf>; DESCRIPTION: SURFACE MOUNT SCHOTTKY BARRIER RECTIFIER; HEIGHT: 1.3mm; MANUFACTURER_NAME: MDDMicrodiode Electronics; MANUFACTURER_PART_NUMBER: SS54F
IC2 = Arduino-ucs&SoCs:SAM-M8Q: u-blox SAM GNSS antenna module; CODE-ARDUINO: SAM-M8Q-0-10; DATASHEET: https://www.u-blox.com/sites/default/files/SAM-M8Q_DataSheet_%28UBX-16012619%29.pdf; DISTRIBUTOR-LINK: https://www.digikey.com/product-detail/en/u-blox-america-inc/SAM-M8Q-0-10/672-1054-1-ND/7393573; DISTRIBUTOR-PN: 672-1054-1-ND; MANUFACTURER: U-Blox; MANUFACTURER-PN: SAM-M8Q-0-10; NOTE: NO
J1 J3 = SamacSys_Parts:1924004: Base Strip 1924004 Source: Datasheet <https://datasheet.datasheetarchive.com/originals/distributors/Datasheets-DGA26/1812852.pdf>; DESCRIPTION: Base Strip 1924004; HEIGHT: 8.75mm; MANUFACTURER_NAME: Phoenix Contact; MANUFACTURER_PART_NUMBER: 1924004; MOUSER_PART_NUMBER: 651-1924004; MOUSER_PRICE-STOCK: https://www.mouser.com/Search/Refine.aspx?Keyword=651-1924004
J2 = Arduino-connectors:SD_AMPHENOL: Micro SD connector; CODE-BCE: -; CODE-TK2: -; DATASHEET: https://www.amphenolcanada.com/ProductSearch/drawings/AC/1140084168.pdf; DISTRIBUTOR-LINK: http://www.digikey.com/product-detail/en/amphenol-commercial-products/114-00841-68/114-00841-68-1-ND/2187101; DISTRIBUTOR-PN: 114-00841-68-1-ND; MANUFACTURER: Amphenol; MANUFACTURER-PN: 114-00841-68
J4 = SparkFun-Connectors:CONN_03X2: Multi connection point. Often used as Generic Header-pin footprint for 0.1 inch spaced/style header connections You can populate with any combo of single row headers, but if you'd like an exact match, check these: Header - 2x3 (Male, 0.1") <https://www.sparkfun.com/products/12807> (PRT-12807) Header - 2x3 (Female, 0.1") <https://www.sparkfun.com/products/13010> (PRT-13010) 2x3 Pin Shrouded Header <https://www.sparkfun.com/products/10877> (PRT-10877) On any of the 0.1 inch spaced packages, you can populate with these: Break Away Headers - Straight <https://www.sparkfun.com/products/116> (PRT-00116) Break Away Male Headers - Right Angle <https://www.sparkfun.com/products/553> (PRT-00553) Female Headers <https://www.sparkfun.com/products/115> (PRT-00115) Break Away Headers - Machine Pin <https://www.sparkfun.com/products/117> (PRT-00117) Break Away Female Headers - Swiss Machine Pin <https://www.sparkfun.com/products/743> (PRT-00743) Special note: the shrouded connector mates well with our 3x2 ribbon cables: Ribbon Crimp Connector - 6-pin (2x3, Female) <https://www.sparkfun.com/products/10651> (PRT-10651) Ribbon Cable - 6 wire (15ft) <https://www.sparkfun.com/products/10646> (PRT-10646); PROD_ID: CONN-11566
J6 = SparkFun-Connectors:CONN_02: Multi connection point. Often used as Generic Header-pin footprint for 0.1 inch spaced/style header connections On any of the 0.1 inch spaced packages, you can populate with these: Break Away Headers - Straight <https://www.sparkfun.com/products/116> (PRT-00116) Break Away Male Headers - Right Angle <https://www.sparkfun.com/products/553> (PRT-00553) Female Headers <https://www.sparkfun.com/products/115> (PRT-00115) Break Away Headers - Machine Pin <https://www.sparkfun.com/products/117> (PRT-00117) Break Away Female Headers - Swiss Machine Pin <https://www.sparkfun.com/products/743> (PRT-00743) For SCREWTERMINALS and SPRING TERMINALS visit here: Screw Terimnals on SparkFun.com <https://www.sparkfun.com/search/results?term=Screw+Terminals> (5mm/3.5mm/2.54mm spacing) This device is also useful as a general connection point to wire up your design to another part of your project. Our various solder wires solder well into these plated through hole pads. Hook-Up Wire - Assortment (Stranded, 22 AWG) <https://www.sparkfun.com/products/11375> (PRT-11375) Hook-Up Wire - Assortment (Solid Core, 22 AWG) <https://www.sparkfun.com/products/11367> (PRT-11367) View the entire wire category on our website here <https://www.sparkfun.com/categories/141> Special notes: Molex polarized connector foot print use with: PRT-08233 with associated crimp pins and housings. 2.54_SCREWTERM for use with PRT-10571. 3.5mm Screw Terminal footprints for PRT-08084 5mm Screw Terminal footprints for use with PRT-08432
J7-J11 = SamacSys_Parts:796644-2: TE CONNECTIVITY / BUCHANAN - 796644-2 - PIN HEADER, EUROSTYLE, 2 POSITION, 5MM Source: Datasheet <https://www.te.com/commerce/DocumentDelivery/DDEController?Action=showdoc&DocId=Customer Drawing796644C4pdfEnglishENG_CD_796644_C4.pdf796644-2>; ARROW_PART_NUMBER: 796644-2; ARROW_PRICE-STOCK: https://www.arrow.com/en/products/796644-2/te-connectivity; DESCRIPTION: TE CONNECTIVITY / BUCHANAN - 796644-2 - PIN HEADER, EUROSTYLE, 2 POSITION, 5MM; HEIGHT: 8.5mm; MANUFACTURER_NAME: TE Connectivity; MANUFACTURER_PART_NUMBER: 796644-2; MOUSER_PART_NUMBER: 571-796644-2; MOUSER_PRICE-STOCK: https://www.mouser.co.uk/ProductDetail/TE-Connectivity/796644-2?qs=QSmEGMYP8RQpC5yQyD9ycQ%3D%3D
L2 = SamacSys_Parts:XAL6060-153MEC: COILCRAFT - XAL6060-153MEC - INDUCTOR, 15UH, 6A, 20%, PWR, 11MHZ Source: Datasheet <https://www.coilcraft.com/pdfs/xal60xx.pdf>; DESCRIPTION: COILCRAFT - XAL6060-153MEC - INDUCTOR, 15UH, 6A, 20%, PWR, 11MHZ; HEIGHT: mm; MANUFACTURER_NAME: COILCRAFT; MANUFACTURER_PART_NUMBER: XAL6060-153MEC; MOUSER_PART_NUMBER: 994-XAL6060-153MEC; MOUSER_PRICE-STOCK: https://www.mouser.co.uk/ProductDetail/Coilcraft/XAL6060-153MEC?qs=zCSbvcPd3pYHXGDXbm%2FWuA%3D%3D
MD1 = Arduino - MKR WIFI 1010:ARDUINO_MKR_WIFI_1010: Arduino MKR WiFi 1010; AUTOMOTIVE: No; CENTROID_NOT_SPECIFIED: No; CORE_ARCHITECTURE: ARM Cortex-M0+; DATASHEET: https://store.arduino.cc/mkr-wifi-1010; DATA_BUS_WIDTH: 32bits; DEVICE_CLASS_L1: Integrated Circuits (ICs); DEVICE_CLASS_L2: Embedded Processors and Controllers; DEVICE_CLASS_L3: Microcontrollers; DIGIKEY_DESCRIPTION: UNK ARDUINO MKR WIFI 1010; DIGIKEY_PART_NUMBER: 1050-1162-ND; FOOTPRINT_VARIANT_NAME_0: Recommended_Land_Pattern; FREQUENCY: 48MHz; INTERFACE: I2C,SPI,UART,I2S; LEAD_FREE: Yes; MAX_SUPPLY_VOLTAGE: 5V; MEMORY_SIZE: 256KBytes; MEMORY_TYPE: FLASH; MF: Arduino; MFG_PACKAGE_IDENT: MKR WIFI 1010; MFG_PACKAGE_IDENT_DATE: 0; MFG_PACKAGE_IDENT_REV: 0; MIN_SUPPLY_VOLTAGE: 3.3V; MOUSER_PART_NUMBER: 782-ABX00023; MPN: MKR WIFI 1010; NUMBER_OF_A/D_CONVERTERS: 1; NUMBER_OF_ADC_CHANNELS: 7; NUMBER_OF_I/OS: 8; NUMBER_OF_I2C_CHANNELS: 1; NUMBER_OF_PWM_CHANNELS: 12; NUMBER_OF_SPI_CHANNELS: 1; NUMBER_OF_UART_CHANNELS: 1; PACKAGE: EVALUATION_BOARD; PREFIX: MD; RAM_SIZE: 32KBytes; ROHS: Yes; VERIFICATION_VERSION: 0.0.0.3
Q1 = SamacSys_Parts:SQA403EJ-T1_GE3: MOSFET -30V Vds 20V Vgs PowerPAK SC-70 Source: Datasheet <http://www.mouser.com/datasheet/2/427/sqa403ej-1324569.pdf>; ARROW_PART_NUMBER: SQA403EJ-T1_GE3; ARROW_PRICE-STOCK: https://www.arrow.com/en/products/sqa403ej-t1-ge3/vishay; DESCRIPTION: MOSFET -30V Vds 20V Vgs PowerPAK SC-70; HEIGHT: 0.8mm; MANUFACTURER_NAME: Vishay; MANUFACTURER_PART_NUMBER: SQA403EJ-T1_GE3; MOUSER_PART_NUMBER: 78-SQA403EJ-T1_GE3; MOUSER_PRICE-STOCK: https://www.mouser.co.uk/ProductDetail/Vishay-Siliconix/SQA403EJ-T1_GE3?qs=y6ZabgHbY%252BztlKTMR7l9uw%3D%3D
Q2 Q3 = SamacSys_Parts:SUD23N06-31-GE3: Vishay SUD23N06-31-GE3 N-channel MOSFET Transistor, 23 A, 60 V, 3-Pin TO-252 Source: Datasheet <https://www.vishay.com/docs/68857/sud23n06.pdf>; DESCRIPTION: Vishay SUD23N06-31-GE3 N-channel MOSFET Transistor, 23 A, 60 V, 3-Pin TO-252; HEIGHT: 2.52mm; MANUFACTURER_NAME: Vishay; MANUFACTURER_PART_NUMBER: SUD23N06-31-GE3; MOUSER_PART_NUMBER: 781-SUD23N06-31-GE3; MOUSER_PRICE-STOCK: https://www.mouser.co.uk/ProductDetail/Vishay-Semiconductors/SUD23N06-31-GE3?qs=IRuQNBqMOcmCWAQbquTGqQ%3D%3D
R1-R9 R11-R38 R50-R60 R72-R82 = rcl:R-EU_: RESISTOR, European symbol; SPICEPREFIX: R
R10 = rcl:R-EU_: RESISTOR, European symbol; MPN: RC0402FR-07100KL; SPICEPREFIX: R
R39 = SparkFun-Resistors:1MOHM: 1MΩ resistor A resistor is a passive two-terminal electrical component that implements electrical resistance as a circuit element. Resistors act to reduce current flow, and, at the same time, act to lower voltage levels within circuits. - Wikipedia; PROD_ID: RES-15185
R40 R43 R44 = SparkFun-Resistors:1MOHM: 1MΩ resistor A resistor is a passive two-terminal electrical component that implements electrical resistance as a circuit element. Resistors act to reduce current flow, and, at the same time, act to lower voltage levels within circuits. - Wikipedia; PROD_ID: RES-15185; VALUE: 1M
R41 R42 = microbuilder:RESISTOR: Resistors 0402 - 0402 Surface Mount Package 22 Ohm 1% 1/16W [Digikey: 311-22.0LRTR-ND] 33 Ohm 5% 1/16W 1.0K 5% 1/16W 1.5K 5% 1/16W 2.0K 1% 1/16W 10.0K 1% 1/16W [Digikey: 311-10.0KLRTR-ND] 10.0K 5% 1/16W [Digikey: RMCF0402JT10K0TR-ND] 12.1K 1% 1/16W [Digikey: 311-22.0LRTR-ND] 100.0K 5% 1/16W 0603 - 0603 Surface Mount Package 0 Ohm 1/10 Watt 1% Resistor 15 Ohm 1/10 Watt 1% Resistor 33 Ohm 1/10 Watt 1% Resistor 49.9 Ohm 1/10 Watt 1% Resistor 100 Ohm 1/10 Watt 1% Resistor 150 Ohm 1/10 Watt 1% Resistor 240 Ohm 1/10 Watt 1% Resistor 390 Ohm 1/10 Watt 1% Resistor 560 Ohm 1/10 Watt 1% Resistor 680 Ohm 1/10 Watt 1% Resistor 750 Ohm 1/10 Watt 1% Resistor 1.0K Ohm 1/10 Watt 1% Resistor 1.5K Ohm 1/10 Watt 1% Resistor 2.0K Ohm 1/10 Watt 1% Resistor 2.2K Ohm 1/10 Watt 1% Resistor 3.3K Ohm 1/10 Watt 1% Resistor 4.7K Ohm 1/10 Watt 1% Resistor 10.0K Ohm 1/10 Watt 1% Resistor 12.0K Ohm 1/10 Watt 1% Resistor 12.1K Ohm 1/10 Watt 1% Resistor 20.0K Ohm 1/10 Watt 1% Resistor 33.0K Ohm 1/10 Watt 1% Resistor 100.0K Ohm 1/10 Watt 1% Resistor 0805 - 0805 Surface Mount Package 0 Ohm 1/8 Watt 1% Resistor 33 Ohm 1/8 Watt 1% Resistor 100 Ohm 1/8 Watt 1% Resistor 150 Ohm 1/8 Watt 1% Resistor 200 Ohm 1/8 Watt 1% Resistor 240 Ohm 1/8 Watt 1% Resistor 330 Ohm 1/8 Watt 1% Resistor 390 Ohm 1/8 Watt 1% Resistor 470 Ohm 1/8 Watt 1% Resistor 1.0K Ohm 1/8 Watt 1% Resistor 1.5K Ohm 1/8 Watt 1% Resistor 2.0K Ohm 1/8 Watt 1% Resistor 4.7K Ohm 1/8 Watt 1% Resistor 5.1K Ohm 1/8 Watt 1% Resistor 5.6K Ohm 1/8 Watt 1% Resistor 10.0K Ohm 1/8 Watt 1% Resistor 22.0K Ohm 1/8 Watt 1% Resistor 33.0K Ohm 1/8 Watt 1% Resistor 100K Ohm 1/8 Watt 1% Resistor 1206 - 1206 Surface Mount Package 2012 - 2010 Surface Mount Package 0.11 Ohm 1/2 Watt 1% Resistor - Digikey: RHM.11UCT-ND
TP1-TP4 = SparkFun-Connectors:TEST-POINT: SparkFun Test Points Bare copper test points for troubleshooting or In-Circuit-Testing. These are used by our Production team for verifying production board runs using pogo-pins on test beds. SparkFun Products: SparkFun LSM9DS1 Breakout <https://www.sparkfun.com/products/13284> SparkFun PSOC <https://www.sparkfun.com/products/13714> SparkFun Load Cell Amplifier <https://www.sparkfun.com/products/13879>
TP5-TP13 = microbuilder:TESTPOINT: Test Point Various test points for characterisation and PCB testing TESTPOINT_SMT - Compact Surface Mount Test Point [Digikey: 5016KTR-ND]
U2 = TPS5450DDAR:TPS5450DDAR: 5.5V to 36V Input, 5A, 500kHz Step Down Converter 8-SO PowerPAD -40 to 125 Check prices <https://pricing.snapeda.com/parts/TPS5450DDAR/Texas%20Instruments/view-part?ref=eda>; AVAILABILITY: In Stock; DESCRIPTION: 5.5V to 36V Input, 5A, 500kHz Step Down Converter 8-SO PowerPAD -40 to 125; MF: Texas Instruments; MP: TPS5450DDAR; PACKAGE: HSOIC-8 Texas Instruments; PRICE: None; PURCHASE-URL: https://pricing.snapeda.com/search/part/TPS5450DDAR/?ref=eda
U3 = LMC7660IMX_NOPB:LMC7660IMX/NOPB; COPYRIGHT: Copyright (C) 2022 Ultra Librarian. All rights reserved.; MANUFACTURER_PART_NUMBER: LMC7660IMX/NOPB; MFR_NAME: Texas Instruments
U4 U6 U8 U10 = LM324:LM324: these devices consist of four independent high-gain frequency-compensated operational amplifiers that are designed sp... Check availability <https://pricing.snapeda.com/parts/LM324/Texas%20Instruments/view-part?ref=eda>; AVAILABILITY: In Stock; DESCRIPTION: series Converter, RF Power Amplifier Voltage Regulator IC 1 Output 6-DSBGA (1.5x1.3); MF: Texas Instruments; MP: LM324; PACKAGE: SOIC-14 Texas Instruments; PRICE: None; PURCHASE-URL: https://pricing.snapeda.com/search/part/LM324/?ref=eda
U5 = Arduino-Sensors:BNO055: BNO055 - Motion Co-Processor; CODE-BCE: -; CODE-TK2: -; DATASHEET: https://ae-bst.resource.bosch.com/media/_tech/media/datasheets/BST_BNO055_DS000_14.pdf; DISTRIBIUTOR-PN: 828-1058-1-ND; DISTRIBUTOR-LINK: http://www.digikey.it/product-detail/it/bosch-sensortec/BNO055/828-1058-1-ND/6136309; MANUFACTURER: Bosch Sensortec; MANUFACTURER-PN: BNO055
U7 = Arduino-ICs:W25Q*: Flash; CODE-BCE: -; CODE-TK2: -; DATASHEET: https://www.winbond.com/resource-files/w25q16jv%20spi%20revd%2008122016.pdf; DISTRIBUTOR-LINK: https://www.digikey.com/product-detail/it/winbond-electronics/W25Q16JVZPIQ/W25Q16JVZPIQ-ND/6193770; DISTRIBUTOR-PN: W25Q16JVZPIQ-ND; MANUFACTURER: Winbond; MANUFACTURER-PN: W25Q16JVZPIQ
U9 = SparkFun-PowerIC:V_REG_LDO: Voltage Regulator LDO Standard 150mA LDO voltage regulator in SOT-23 layout. Micrel part MIC5205. BP (by-pass) pin is used to lower output noise with 470pF cap.; PROD_ID: VREG-12457
U$2 U$3 = PSU:PDS760-13; MANUFACTURER_PART_NUMBER: PDS76013; VENDOR: Diodes Inc.
U$12 = PSU:LM25118MH/NOPB; MANUFACTURER_PART_NUMBER: LM25118MHNOPB; VENDOR: Texas Instruments
U$16 = PSU:74437358082; MANUFACTURER_PART_NUMBER: 74437358082; VENDOR: Wurth Elektronik
VR3 VR5 VR9 VR13 = SparkFun-Resistors:TRIMPOT: Trimming Potentiometer (Trimpot) Three-terminal potentiometers, with an adjustable wiper and two adjustable resistors. A pot can be used to create a configurable voltage divider, or as a variable resistor. "Trimpots" are a subset of potentiometers, usually intended for "set-and-forget" applications. They're often more delicate than standard potentiometers - rated for fewer turns. Variants PTH-KNOB - PTH Trimpot w/ finger-adjustable knob Trimpot 10K with Knob <https://www.sparkfun.com/products/9806> (COM-09806) Datasheet <http://www.sparkfun.com/datasheets/Components/General/TSR-3386.pdf> SMD-3MM-CLOSED-FRAME - SMD 3mm Square Closed-Frame Trimpot Used on e.g. EasyDriver - Stepper Motor Driver <https://www.sparkfun.com/products/12779> Datasheet <http://www.bitechnologies.com/pdfs/22.pdf> (22AR10KTR) SMD-5MM - SMD 5mm Square Closed-Frame Trimpot Used on e.g. IOIO-OTG - V2.2 <https://www.sparkfun.com/products/13613> Datasheet <http://www.vishay.com/docs/51008/ts53.pdf> (TS53YL502MR10) SMD-3MM-1/10W-25% - 3mm Square Open-Frame Trimpot Used on e.g. SparkFun Shapeoko <https://www.sparkfun.com/products/13899> Datasheet <http://www.bourns.com/docs/Product-Datasheets/TC33.pdf> (TC33X-2-103E); PROD_ID: RES-09285
VR4 VR6 VR10 VR14 = SparkFun-Resistors:TRIMPOT: Trimming Potentiometer (Trimpot) Three-terminal potentiometers, with an adjustable wiper and two adjustable resistors. A pot can be used to create a configurable voltage divider, or as a variable resistor. "Trimpots" are a subset of potentiometers, usually intended for "set-and-forget" applications. They're often more delicate than standard potentiometers - rated for fewer turns. Variants PTH-KNOB - PTH Trimpot w/ finger-adjustable knob Trimpot 10K with Knob <https://www.sparkfun.com/products/9806> (COM-09806) Datasheet <http://www.sparkfun.com/datasheets/Components/General/TSR-3386.pdf> SMD-3MM-CLOSED-FRAME - SMD 3mm Square Closed-Frame Trimpot Used on e.g. EasyDriver - Stepper Motor Driver <https://www.sparkfun.com/products/12779> Datasheet <http://www.bitechnologies.com/pdfs/22.pdf> (22AR10KTR) SMD-5MM - SMD 5mm Square Closed-Frame Trimpot Used on e.g. IOIO-OTG - V2.2 <https://www.sparkfun.com/products/13613> Datasheet <http://www.vishay.com/docs/51008/ts53.pdf> (TS53YL502MR10) SMD-3MM-1/10W-25% - 3mm Square Open-Frame Trimpot Used on e.g. SparkFun Shapeoko <https://www.sparkfun.com/products/13899> Datasheet <http://www.bourns.com/docs/Product-Datasheets/TC33.pdf> (TC33X-2-103E); PROD_ID: RES-09285; VALUE: 10k
Y2 = Arduino-crystals:32.768KHZ: LF crystal; CODE-BCE: -; CODE-TK2: -; DATASHEET: http://www.abracon.com/Resonators/ABS07.pdf; DISTRIBUTOR-LINK: http://www.digikey.com/product-detail/en/abracon-llc/ABS07-32.768KHZ-T/535-9542-1-ND/1237009; DISTRIBUTOR-PN: 535-9542-1-ND; MANUFACTURER: Abracon LLC; MANUFACTURER-PN: ABS07-32.768KHZ-T